# EAGLE design untitled (EAGLE 7.5.0)
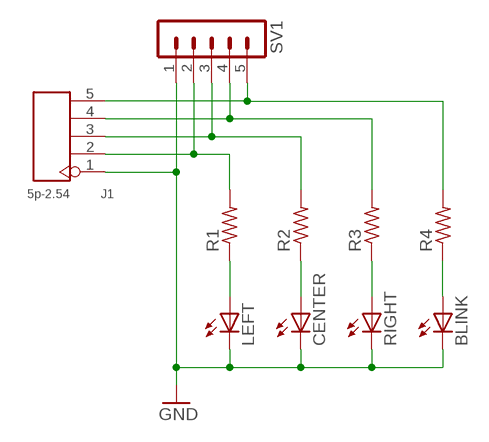
[diagram p0: schematic, sheet 1]

## Parts
BLINK  LED5MM  [LED5MM]
CENTER  LED5MM  [LED5MM]
J1  5p-2.54  DIP-SCREW-TERMINAL(5P-2.54)  [H5-2.54-11.06X6.3MM]
LEFT  LED5MM  [LED5MM]
R1  FLIPFLOP-RES  [0805-THM]
R2  FLIPFLOP-RES  [0805-THM]
R3  FLIPFLOP-RES  [0805-THM]
R4  FLIPFLOP-RES  [0805-THM]
RIGHT  LED5MM  [LED5MM]
SV1  MA05-1  [MA05-1]

## Nets
GND: BLINK.K(C) CENTER.K(C) J1.1 LEFT.K(C) RIGHT.K(C) SV1.1
N$1: J1.4 R3.2 SV1.4
N$2: LEFT.A R1.1
N$3: BLINK.A R4.1
N$4: R3.1 RIGHT.A
N$5: CENTER.A R2.1
N$7: J1.2 R1.2 SV1.2
N$8: J1.5 R4.2 SV1.5
N$9: J1.3 R2.2 SV1.3

## Library data of the parts
BLINK CENTER LEFT RIGHT = adafruit:LED: LED OSRAM: - CHIPLED LG R971, LG N971, LY N971, LG Q971, LY Q971, LO R971, LY R971 LH N974, LH R974 LS Q976, LO Q976, LY Q976 LO Q996 - Hyper CHIPLED LW Q18S LB Q993, LB Q99A, LB R99A - SideLED LS A670, LO A670, LY A670, LG A670, LP A670 LB A673, LV A673, LT A673, LW A673 LH A674 LY A675 LS A676, LA A676, LO A676, LY A676, LW A676 LS A679, LY A679, LG A679 - Hyper Micro SIDELED® LS Y876, LA Y876, LO Y876, LY Y876 LT Y87S - SmartLED LW L88C, LW L88S LB L89C, LB L89S, LG L890 LS L89K, LO L89K, LY L89K LS L896, LA L896, LO L896, LY L896 - TOPLED LS T670, LO T670, LY T670, LG T670, LP T670 LSG T670, LSP T670, LSY T670, LOP T670, LYG T670 LG T671, LOG T671, LSG T671 LB T673, LV T673, LT T673, LW T673 LH T674 LS T676, LA T676, LO T676, LY T676, LB T676, LH T676, LSB T676, LW T676 LB T67C, LV T67C, LT T67C, LS T67K, LO T67K, LY T67K, LW E67C LS E67B, LA E67B, LO E67B, LY E67B, LB E67C, LV E67C, LT E67C LW T67C LS T679, LY T679, LG T679 LS T770, LO T770, LY T770, LG T770, LP T770 LB T773, LV T773, LT T773, LW T773 LH T774 LS E675, LA E675, LY E675, LS T675 LS T776, LA T776, LO T776, LY T776, LB T776 LHGB T686 LT T68C, LB T68C - Hyper Mini TOPLED® LB M676 - Mini TOPLED Santana® LG M470 LS M47K, LO M47K, LY M47K Source: http://www.osram.convergy.de/
J1 = Seeed-OPL-Connector:DIP-SCREW-TERMINAL(5P-2.54): 320110145; MPN: GS019-5P-1
R1-R4 = adafruit:FLIPFLOP-RES: Flip Flop resistor An 0805 resistor inside a standard 1/4W 5% resistor. Makes for easy mods
SV1 = con-lstb:MA05-1: PIN HEADER; OC_FARNELL: unknown; OC_NEWARK: unknown

## Net classes
0 default: width 0.05 mm

## Board
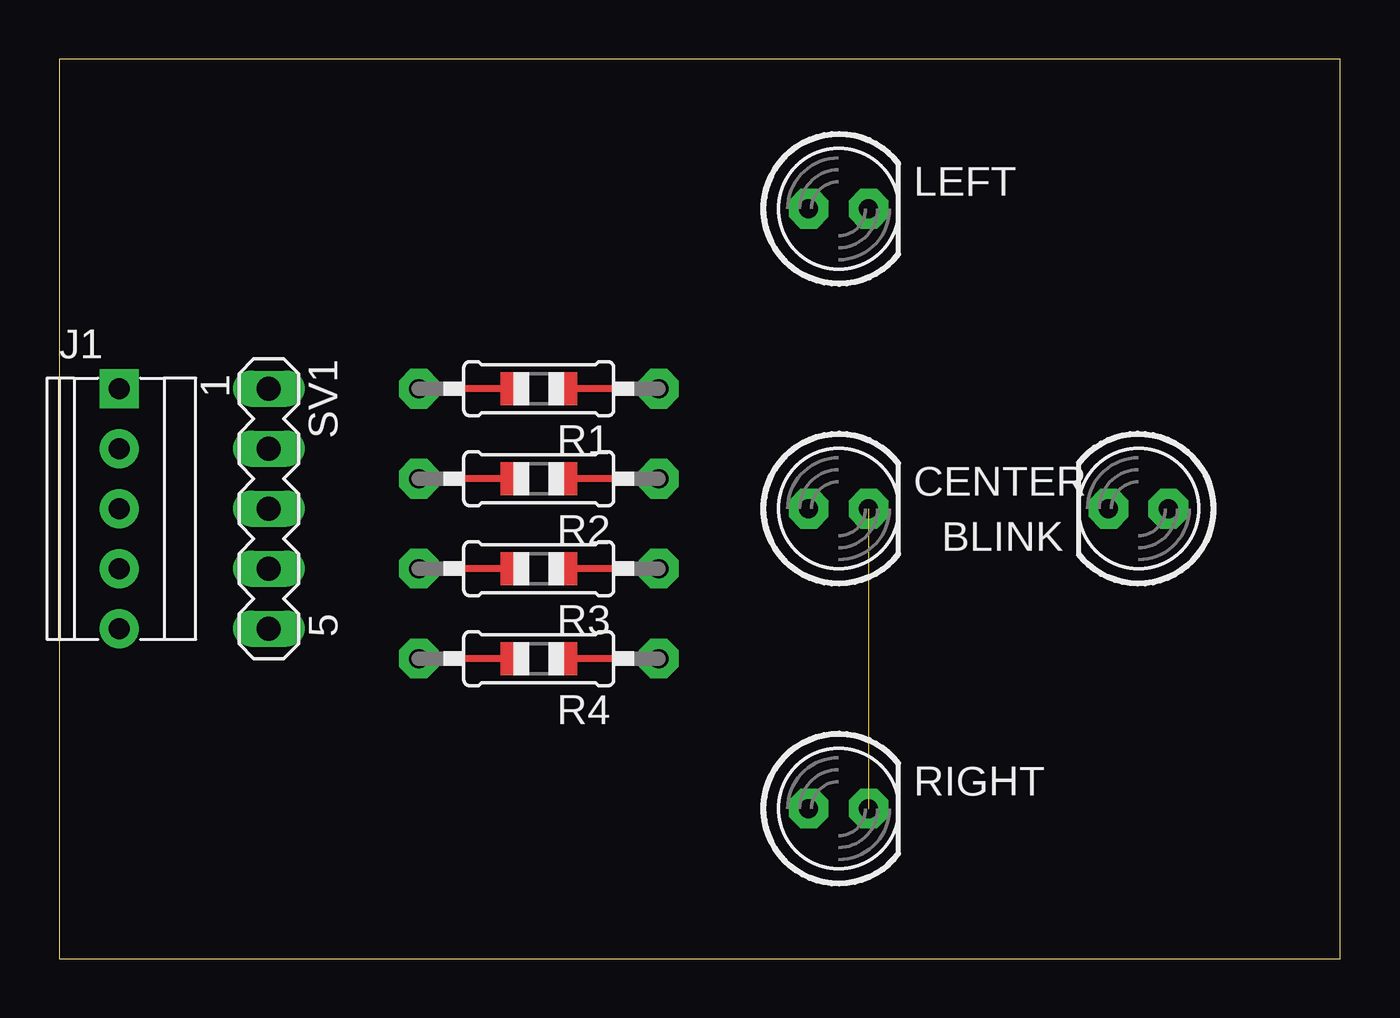
[diagram p1: board, top side]
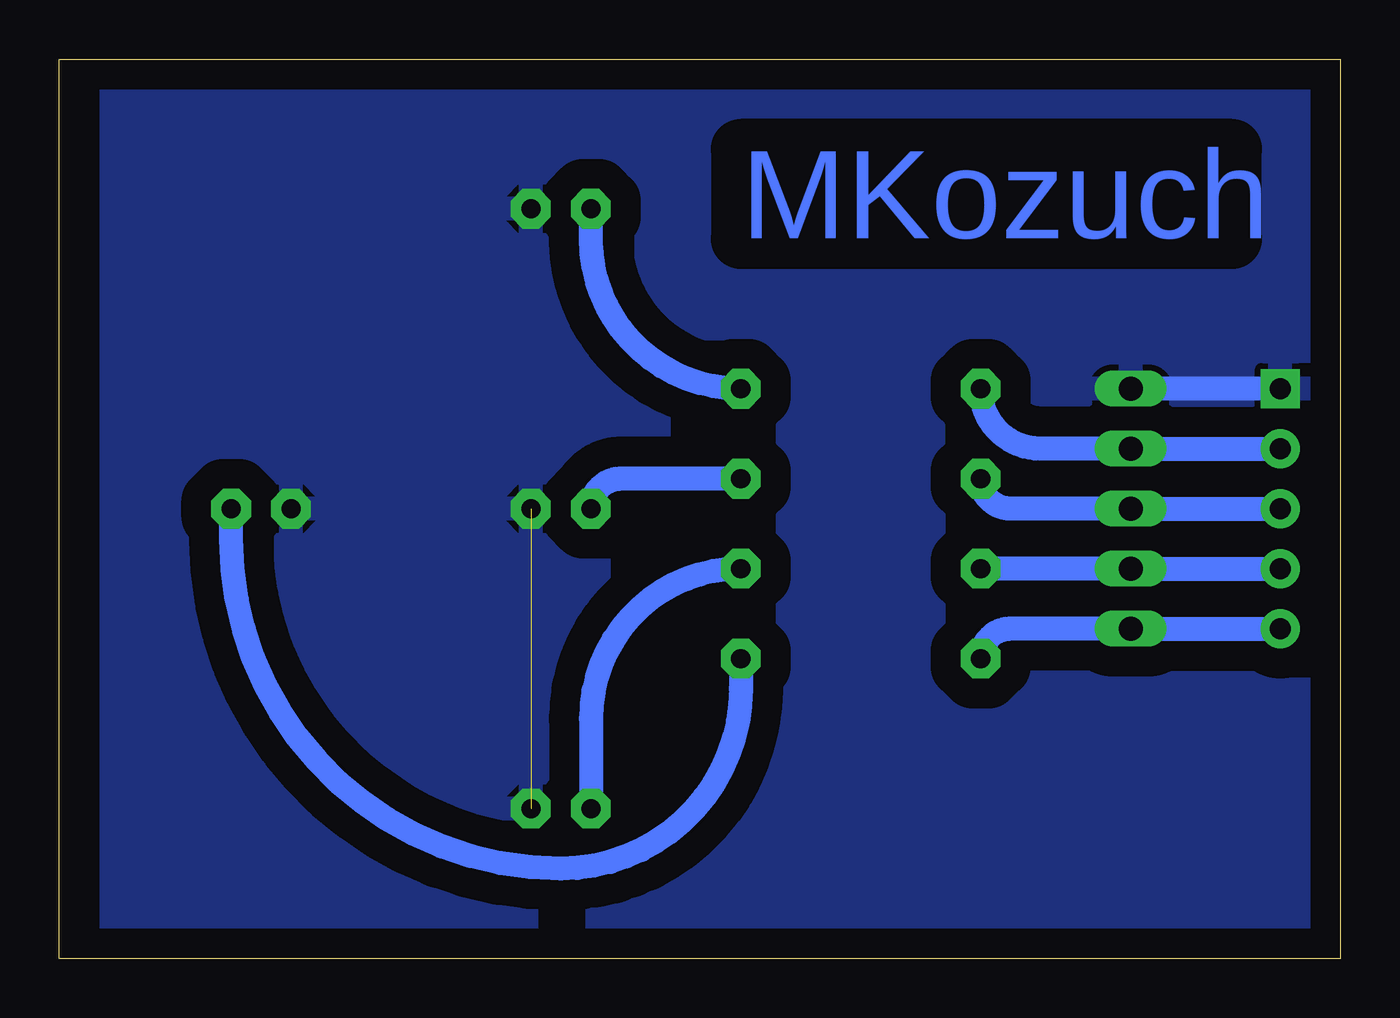
[diagram p2: board, bottom side, seen from below]

Size 54.28 x 38.09 mm. Coordinates in mm from the lower left corner, seen from the top.
Outline: 0,0 54.28,0 54.28,38.09 0,38.09 0,0
Copper layers (1*16): Top 0.035mm / dielectric 1.5mm / Bottom 0.035mm
Design rules "default": minimum track width 10mil, minimum drill 24mil, track to track 8mil, track to pad 8mil, pad to pad 8mil, via to via 8mil, smd to smd 8mil, copper to edge 40mil, drill to drill 8mil, minimum pad ring 10mil, minimum via ring 8mil, stop-mask expansion 4mil, vias tented up to drill 0mil, thermal gap 10mil

### Footprints (pad centres in the part's own frame; a part is rotated, then mirrored left to right if it is on the bottom)
LED5MM = drill 0.813 pad 1.676 octagon: A -1.27,0; K 1.27,0
H5-2.54-11.06X6.3MM = drill 0.889 pad 1.651 square: 1 0,5.08 | drill 0.889 pad 1.651: 2 0,2.54; 3 0,0; 4 0,-2.54; 5 0,-5.08
0805-THM = drill 0.813 pad 1.676 octagon: 1 -5.08,0; 2 5.08,0
MA05-1 = drill 1.016 long: 1 -5.08,0; 2 -2.54,0; 3 0,0; 4 2.54,0; 5 5.08,0

### Placement (x,y rotation side)
BLINK  45.72,19.05 180 top
CENTER  33.02,19.05 0 top
J1  2.54,19.05 0 top
LEFT  33.02,31.75 0 top
R1  20.32,24.13 180 top
R2  20.32,20.32 180 top
R3  20.32,16.51 180 top
R4  20.32,12.7 180 top
RIGHT  33.02,6.35 0 top
SV1  8.89,19.05 270 top

### Tracks (layer width: path | path; a pad name or v marks a point on that pad's centre or on a via)
GND  (1 unrouted)
  Bottom 1.016: J1.1 SV1.1
  pour Bottom (isolate 1.27): 1.27,36.83 52.07,36.83 52.07,1.27 1.27,1.27
N$1
  Bottom 1.016: J1.4 SV1.4 R3.2
N$2
  Bottom 1.016: R1.1 arc90 31.75,30.48 LEFT.A
N$3
  Bottom 1.016: R4.1 25.4,11.43 arc90 33.02,3.81 arc90 46.99,17.78 BLINK.A
N$4
  Bottom 1.016: R3.1 arc-90 31.75,10.16 RIGHT.A
N$5
  Bottom 1.016: R2.1 30.48,20.32 arc-90 CENTER.A
N$7
  Bottom 1.016: J1.2 SV1.2 12.7,21.59 arc90 R1.2
N$8
  Bottom 1.016: J1.5 SV1.5 13.97,13.97 arc-90 R4.2
N$9
  Bottom 1.016: J1.3 SV1.3 13.97,19.05 arc90 R2.2

### Text on the board
Bottom: MKozuch